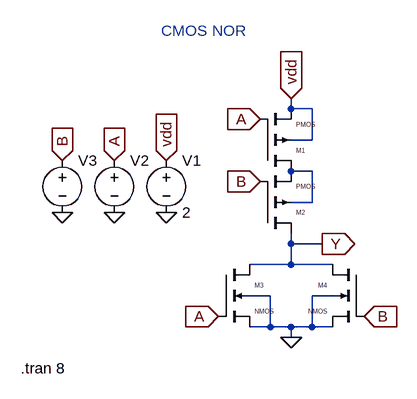
[diagram p0: schematic CMOS NOR.asc]
CMOS NOR.asc, the LTspice schematic file:
Version 4
SHEET 1 880 680
WIRE 256 16 256 0
WIRE 288 16 256 16
WIRE 288 64 288 16
WIRE 288 64 256 64
WIRE 288 112 256 112
WIRE 288 160 288 112
WIRE 288 160 256 160
WIRE 256 224 256 208
WIRE 304 224 256 224
WIRE 256 256 256 224
WIRE 256 256 192 256
WIRE 320 256 256 256
WIRE 224 304 192 304
WIRE 320 304 288 304
WIRE 224 352 224 304
WIRE 224 352 192 352
WIRE 256 352 224 352
WIRE 288 352 288 304
WIRE 288 352 256 352
WIRE 320 352 288 352
WIRE 256 368 256 352
FLAG 256 0 vdd
IOPIN 256 0 In
FLAG 64 96 vdd
IOPIN 64 96 In
FLAG 208 32 A
IOPIN 208 32 In
FLAG -16 96 A
IOPIN -16 96 In
FLAG 144 336 A
IOPIN 144 336 In
FLAG -96 96 B
IOPIN -96 96 In
FLAG 208 128 B
IOPIN 208 128 In
FLAG 368 336 B
IOPIN 368 336 In
FLAG 64 176 0
FLAG -16 176 0
FLAG -96 176 0
FLAG 256 368 0
FLAG 304 224 Y
IOPIN 304 224 Out
SYMBOL pmos4 208 112 M180
WINDOW 0 56 32 Left 0
WINDOW 3 56 72 Left 0
SYMATTR InstName M1
SYMBOL pmos4 208 208 M180
WINDOW 0 56 32 Left 0
WINDOW 3 56 72 Left 0
SYMATTR InstName M2
SYMBOL nmos4 144 256 R0
WINDOW 0 56 32 Left 0
WINDOW 3 56 72 Left 0
SYMATTR InstName M3
SYMBOL nmos4 368 256 M0
WINDOW 0 56 32 Left 0
WINDOW 3 56 72 Left 0
SYMATTR InstName M4
SYMBOL voltage 64 80 R0
WINDOW 123 0 0 Left 0
WINDOW 39 0 0 Left 0
SYMATTR InstName V1
SYMATTR Value 2
SYMBOL voltage -96 80 R0
WINDOW 3 24 96 Invisible 2
WINDOW 123 0 0 Left 0
WINDOW 39 0 0 Left 0
SYMATTR Value PULSE(0 2 0 0.001 0.001 4 8)
SYMATTR InstName V3
SYMBOL voltage -16 80 R0
WINDOW 3 24 96 Invisible 2
WINDOW 123 0 0 Left 0
WINDOW 39 0 0 Left 0
SYMATTR Value PULSE(0 2 0 0.001 0.001 2 4)
SYMATTR InstName V2
TEXT -160 416 Left 2 !.tran 8
TEXT 56 -104 Left 2 ;CMOS NOR

The netlist it stands for:
* CMOS NOR.asc
M1 N001 A vdd vdd PMOS
M2 Y B N001 N001 PMOS
M3 Y A 0 0 NMOS
M4 Y B 0 0 NMOS
V1 vdd 0 2
V3 B 0 PULSE(0 2 0 0.001 0.001 4 8)
V2 A 0 PULSE(0 2 0 0.001 0.001 2 4)
.model NMOS NMOS
.model PMOS PMOS
.lib standard.mos
.tran 8
* CMOS NOR
.backanno
.end

* Results of the author's LTspice run, read from the files saved beside the schematic
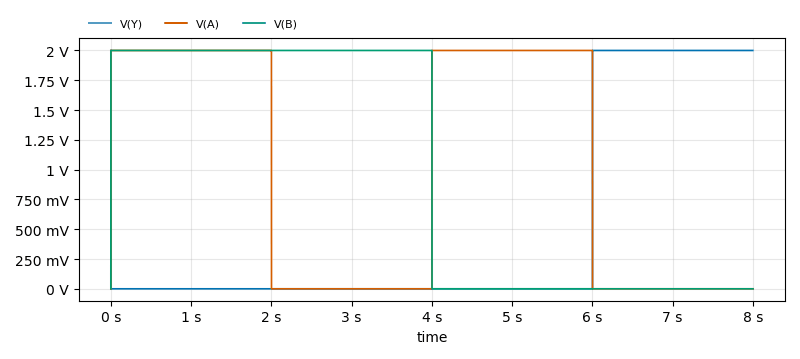
[diagram p1: Transient Analysis of CMOS NOR.asc, plotted from the saved traces]
* Transient Analysis, 1 run:
*   V(Y): min 0 V, max 2.001 V, average 499.7 mV, rms 999.6 mV, last 2 V
*   V(A): min 0 V, max 2 V, average 1 V, rms 1.414 V, last 0 V
*   V(B): min 0 V, max 2 V, average 1 V, rms 1.414 V, last 0 V